# EAGLE design Driver (EAGLE 8.5.2)
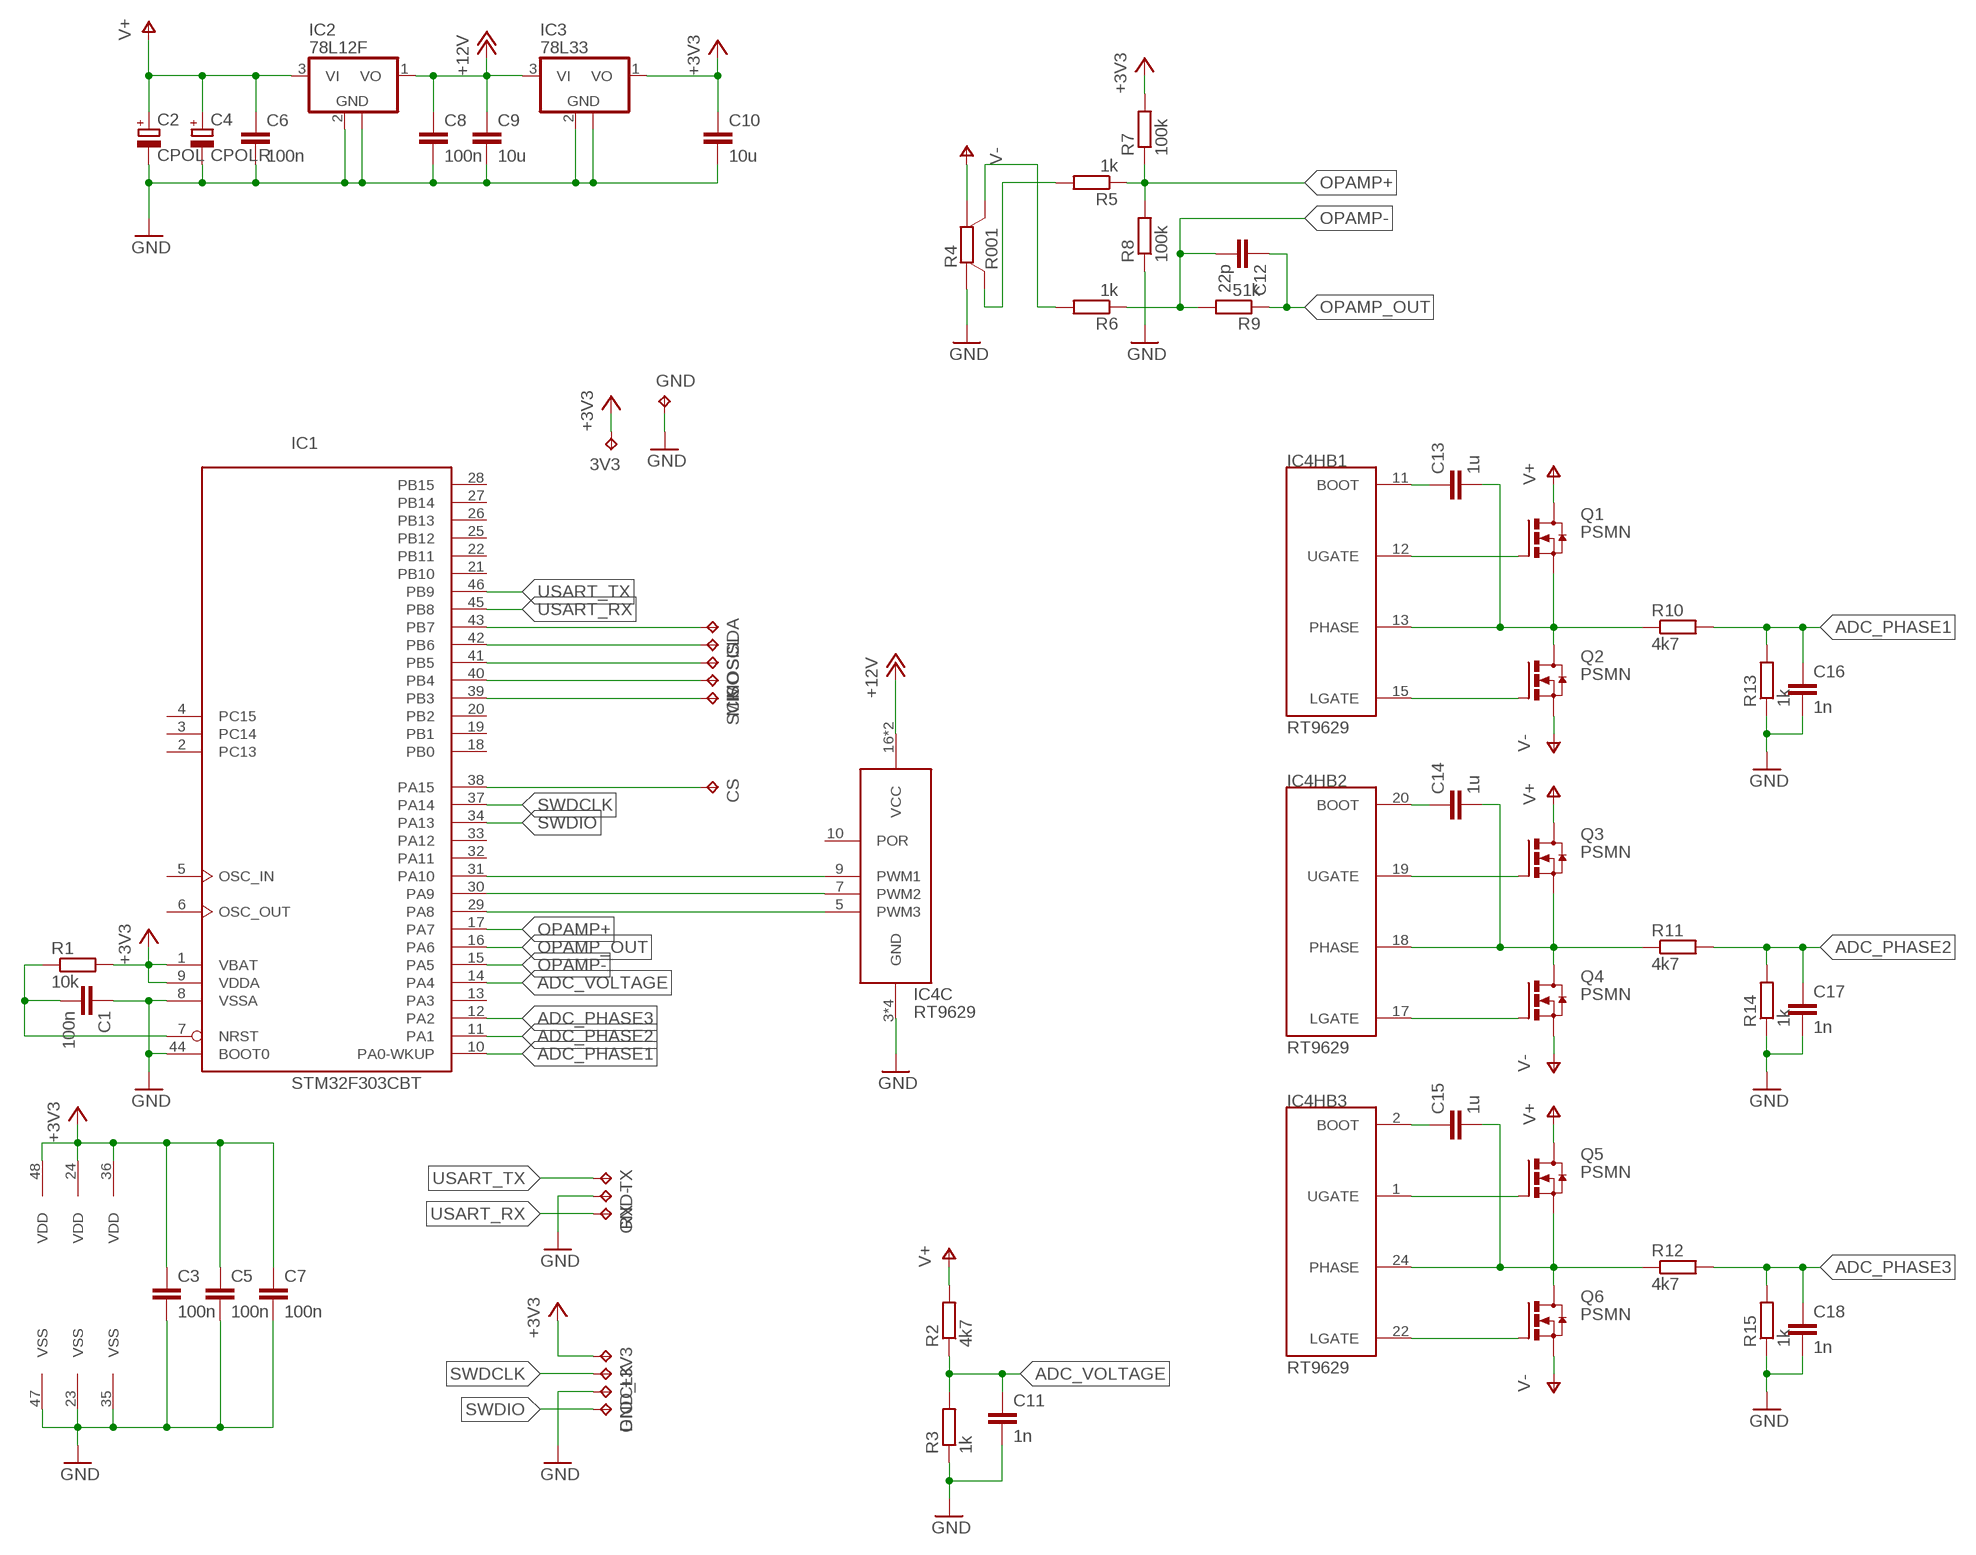
[diagram p0: schematic, sheet 1]

## Parts
3V3  TPTP10SQ  [TP10SQ]
+3V3  TPTP15R  [TP15R]
C1  100n  C-EUC0603K  [C0603K]
C2  CPOL  [SIDEWAYS-5.08]
C3  100n  C-EUC0603K  [C0603K]
C4  CPOLR  [SIDEWAYS-5.08R]
C5  100n  C-EUC0603K  [C0603K]
C6  100n  C-EUC0603K  [C0603K]
C7  100n  C-EUC0603K  [C0603K]
C8  100n  C-EUC0603K  [C0603K]
C9  10u  C-EUC1206K  [C1206K]
C10  10u  C-EUC1206K  [C1206K]
C11  1n  C-EUC0603K  [C0603K]
C12  22p  C-EUC0603K  [C0603K]
C13  1u  C-EUC0603K  [C0603K]
C14  1u  C-EUC0603K  [C0603K]
C15  1u  C-EUC0603K  [C0603K]
C16  1n  C-EUC0603K  [C0603K]
C17  1n  C-EUC0603K  [C0603K]
C18  1n  C-EUC0603K  [C0603K]
CLK  TPTP15R  [TP15R]
CS  TPTP10SQ  [TP10SQ]
DIO  TPTP15R  [TP15R]
GND  TPTP10SQ  [TP10SQ]
GND-  TPTP15SQ  [TP15SQ]
GND_  TPTP15SQ  [TP15SQ]
IC1  STM32F303CBT  [LQFP48]
IC2  78L12F  [SOT89]
IC3  78L33  78L12F  [SOT89]
IC4  RT9629  [WQFN24]
MISO  TPTP10SQ  [TP10SQ]
MOSI  TPTP10SQ  [TP10SQ]
Q1  PSMN  [SOT669]
Q2  PSMN  [SOT669]
Q3  PSMN  [SOT669]
Q4  PSMN  [SOT669]
Q5  PSMN  [SOT669]
Q6  PSMN  [SOT669]
R1  10k  R-EU_R0603  [R0603]
R2  4k7  R-EU_R0603  [R0603]
R3  1k  R-EU_R0603  [R0603]
R4  R001  VISHAY_WSK1216  [WSK1216]
R5  1k  R-EU_R0603  [R0603]
R6  1k  R-EU_R0603  [R0603]
R7  100k  R-EU_R0603  [R0603]
R8  100k  R-EU_R0603  [R0603]
R9  51k  R-EU_R0603  [R0603]
R10  4k7  R-EU_R0603  [R0603]
R11  4k7  R-EU_R0603  [R0603]
R12  4k7  R-EU_R0603  [R0603]
R13  1k  R-EU_R0603  [R0603]
R14  1k  R-EU_R0603  [R0603]
R15  1k  R-EU_R0603  [R0603]
RX  TPTP15R  [TP15R]
SCK  TPTP10SQ  [TP10SQ]
SCL  TPTP10SQ  [TP10SQ]
SDA  TPTP10SQ  [TP10SQ]
TX  TPTP15R  [TP15R]

## Nets
+3V3: 3V3.TP +3V3.TP C3.1 C5.1 C7.1 C10.1 IC1.1(VBAT) IC1.9(VDDA) IC1.24(VDD) IC1.36(VDD) IC1.48(VDD) IC3.1(VO) R1.2 R7.2
+12V: C8.1 C9.1 IC2.1(VO) IC3.3(VI) IC4.16(C:VCC) IC4.21(C:VCC)
ADC_PHASE1: C16.1 IC1.10(PA0-WKUP) R10.2 R13.2
ADC_PHASE2: C17.1 IC1.11(PA1) R11.2 R14.2
ADC_PHASE3: C18.1 IC1.12(PA2) R12.2 R15.2
ADC_VOLTAGE: C11.1 IC1.14(PA4) R2.1 R3.2
GND: C1.1 C2.- C3.2 C4.- C5.2 C6.2 C7.2 C8.2 C9.2 C10.2 C11.2 C16.2 C17.2 C18.2 GND-.TP GND.TP GND_.TP IC1.8(VSSA) IC1.23(VSS) IC1.35(VSS) IC1.44(BOOT0) IC1.47(VSS) IC2.2(GND) IC2.2@1(GND) IC3.2(GND) IC3.2@1(GND) IC4.3(C:GND) IC4.14(C:GND) IC4.23(C:GND) IC4.E(C:GND) R3.1 R4.B R8.1 R13.1 R14.1 R15.1
I2C_SCL: IC1.42(PB6) SCL.TP
I2C_SDA: IC1.43(PB7) SDA.TP
N$2: IC4.12(HB1:UGATE) Q1.4(G)
N$3: IC4.15(HB1:LGATE) Q2.4(G)
N$4: C13.1 IC4.11(HB1:BOOT)
N$6: C14.1 IC4.20(HB2:BOOT)
N$8: IC4.19(HB2:UGATE) Q3.4(G)
N$9: IC4.17(HB2:LGATE) Q4.4(G)
N$10: C15.1 IC4.2(HB3:BOOT)
N$12: IC4.1(HB3:UGATE) Q5.4(G)
N$13: IC4.22(HB3:LGATE) Q6.4(G)
N$14: C1.2 IC1.7(NRST) R1.1
N$15: R4.SA R6.2
N$16: R4.SB R5.2
OPAMP+: IC1.17(PA7) R5.1 R7.1 R8.2
OPAMP-: C12.2 IC1.15(PA5) R6.1 R9.2
OPAMP_OUT: C12.1 IC1.16(PA6) R9.1
PHASE1: C13.2 IC4.13(HB1:PHASE) Q1.1(S) Q1.2(S) Q1.3(S) Q2.MB(D) R10.1
PHASE2: C14.2 IC4.18(HB2:PHASE) Q3.1(S) Q3.2(S) Q3.3(S) Q4.MB(D) R11.1
PHASE3: C15.2 IC4.24(HB3:PHASE) Q5.1(S) Q5.2(S) Q5.3(S) Q6.MB(D) R12.1
PWM1: IC1.31(PA10) IC4.9(C:PWM1)
PWM2: IC1.30(PA9) IC4.7(C:PWM2)
PWM3: IC1.29(PA8) IC4.5(C:PWM3)
SPI_MISO: IC1.40(PB4) MISO.TP
SPI_MOSI: IC1.41(PB5) MOSI.TP
SPI_NSS: CS.TP IC1.38(PA15)
SPI_SCK: IC1.39(PB3) SCK.TP
SWDCLK: CLK.TP IC1.37(PA14)
SWDIO: DIO.TP IC1.34(PA13)
USART_RX: IC1.45(PB8) RX.TP
USART_TX: IC1.46(PB9) TX.TP
V+: C2.+ C4.+ C6.1 IC2.3(VI) Q1.MB(D) Q3.MB(D) Q5.MB(D) R2.2
V-: Q2.1(S) Q2.2(S) Q2.3(S) Q4.1(S) Q4.2(S) Q4.3(S) Q6.1(S) Q6.2(S) Q6.3(S) R4.A
Unconnected: IC1.2(PC13) IC1.3(PC14) IC1.4(PC15) IC1.5(OSC_IN) IC1.6(OSC_OUT) IC1.13(PA3) IC1.18(PB0) IC1.19(PB1) IC1.20(PB2) IC1.21(PB10) IC1.22(PB11) IC1.25(PB12) IC1.26(PB13) IC1.27(PB14) IC1.28(PB15) IC1.32(PA11) IC1.33(PA12) IC4.10(C:POR)

## Library data of the parts
3V3 +3V3 CLK CS DIO GND GND- GND_ MISO MOSI RX SCK SCL SDA TX = testpad:TP: Test pad
C1 C3 C5-C18 = rcl:C-EU: CAPACITOR, European symbol; SPICEPREFIX: C
C2 C4 = custom-lcr:CPOL
IC1 = micro-stm:STM32F303C*T: ARM 32-bit Cortex™-M3 CPU 72 MHz maximum frequency 128 to 256 Kbytes of Flash memory 32 to 40 kbytes of SRAM 37 GPIOs 2.0 to 3.6 V application supply
IC2 IC3 = linear:78L*: POSITOIV-VOLTAGE REGULATORS Output up to 100 mA Source: Datasheet <http://focus.ti.com/lit/ds/symlink/ua78l05.pdf>
IC4 = power-ic:RT9629
Q1-Q6 = custom-fet:PSMN
R1-R3 R5-R15 = rcl:R-EU_: RESISTOR, European symbol; SPICEPREFIX: R
R4 = custom-lcr:VISHAY_WSK1216

## Board
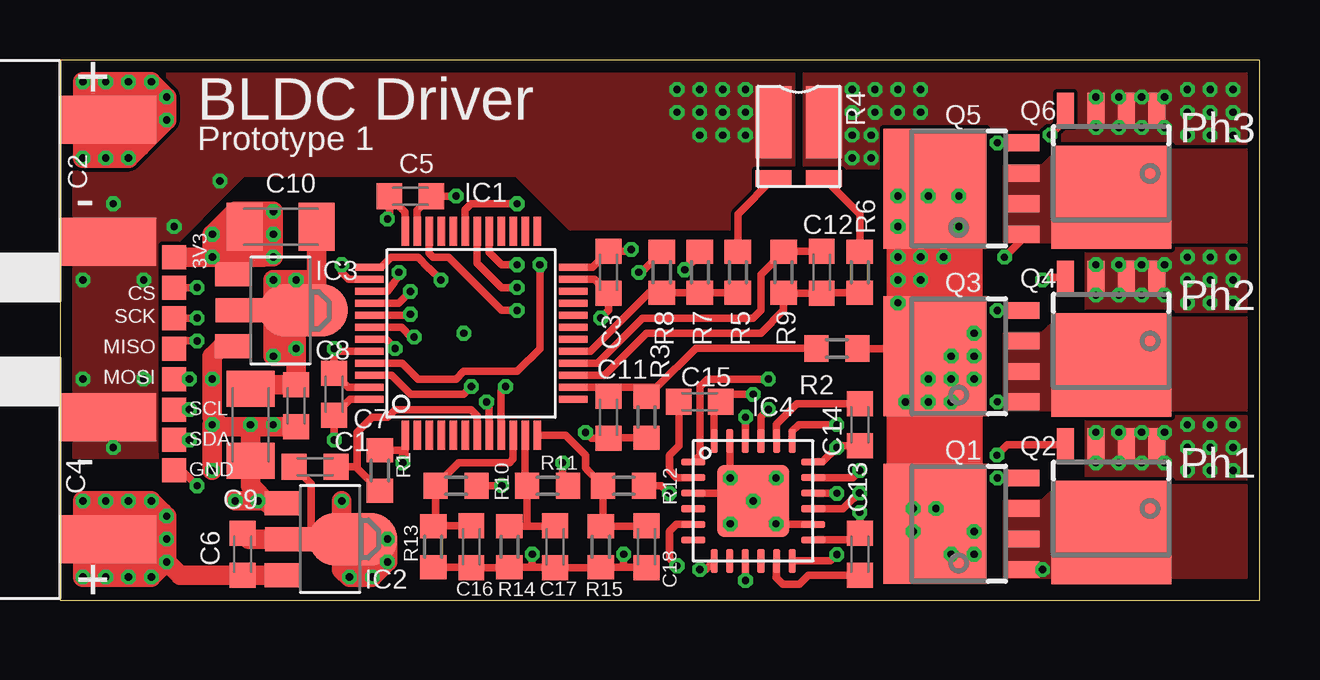
[diagram p1: board, top side]
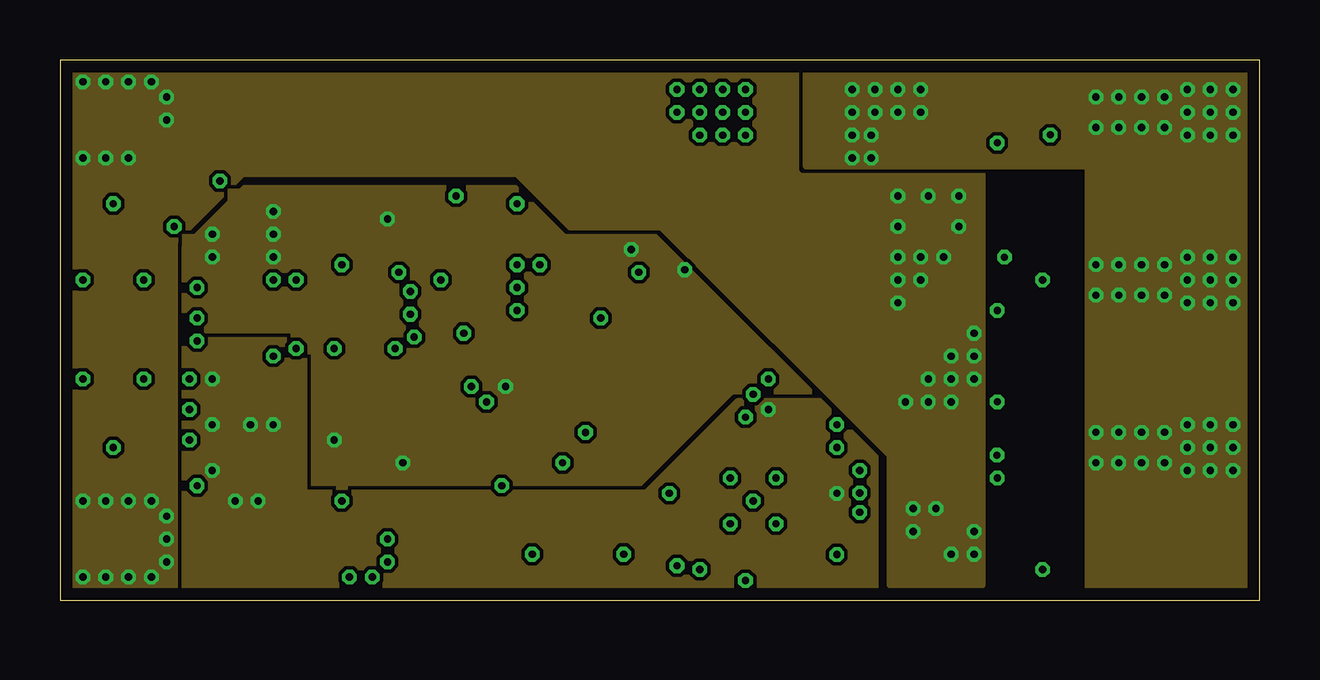
[diagram p2: board, inner layer Route2]
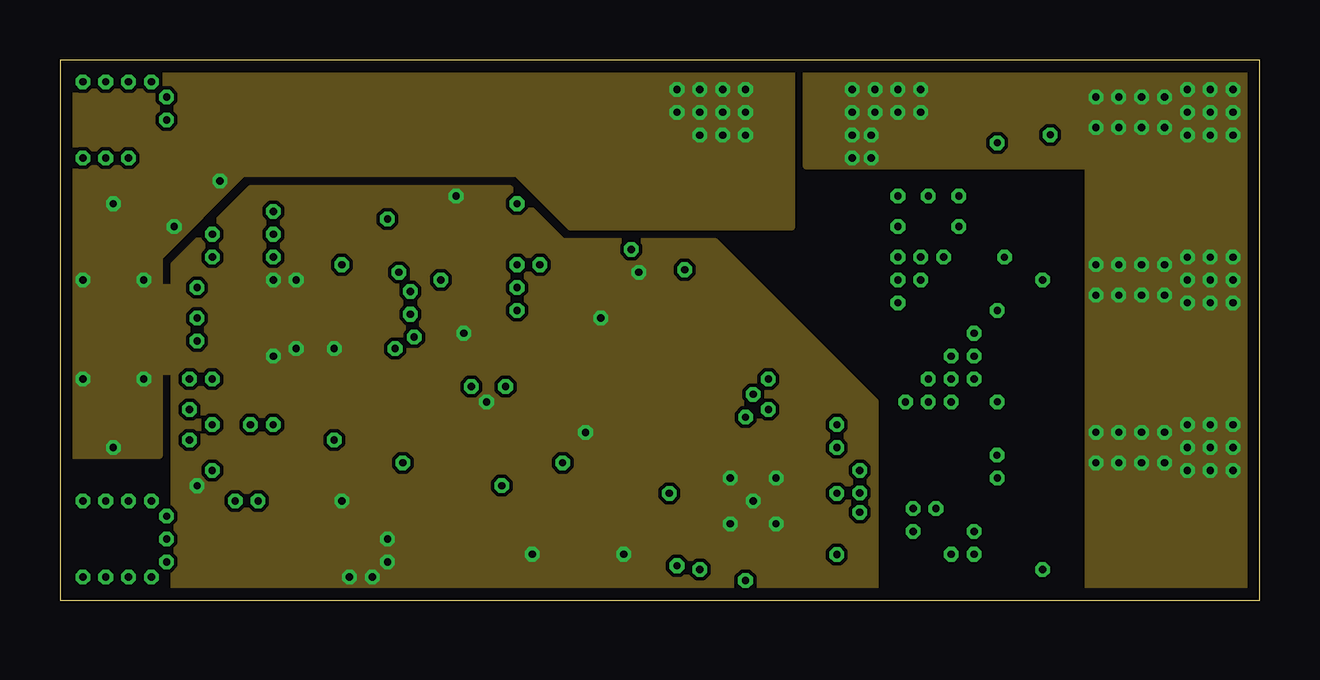
[diagram p3: board, inner layer Route15]
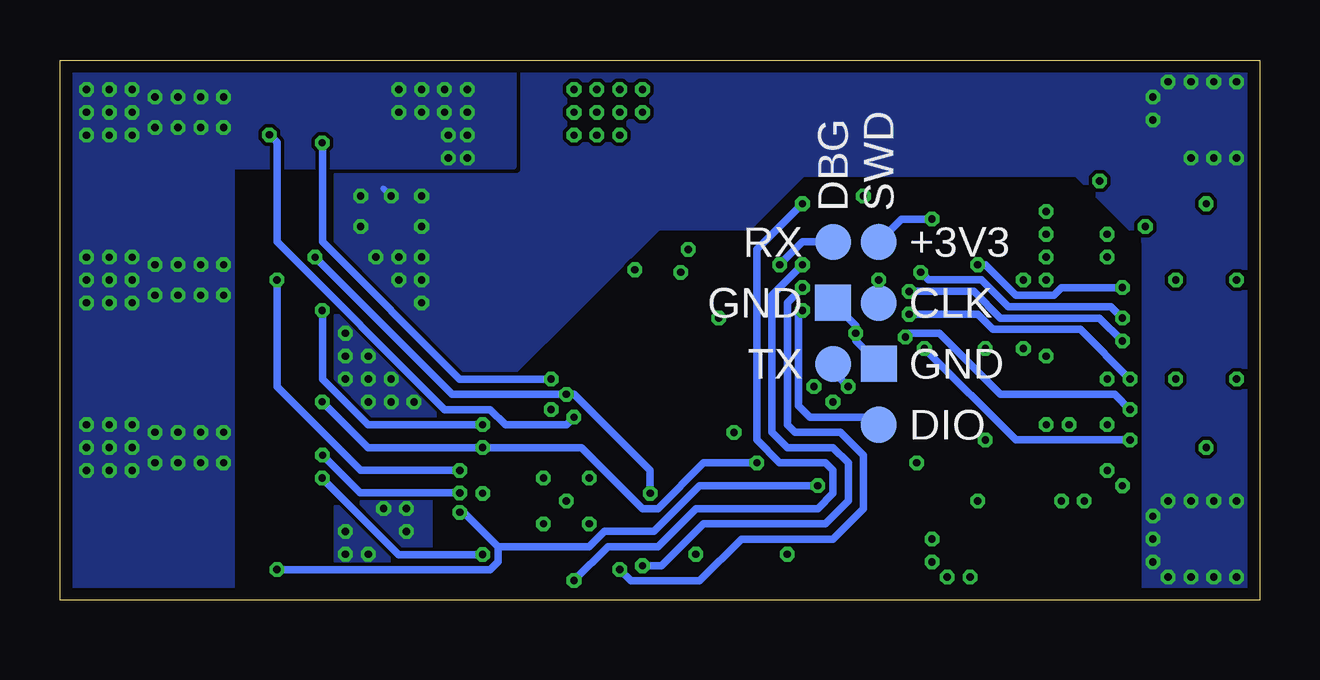
[diagram p4: board, bottom side, seen from below]

Size 50 x 22.5 mm. Coordinates in mm from the lower left corner, seen from the top.
Outline: 0,0 50,0 50,22.5 0,22.5 0,0
Copper layers (1*2*15*16): Top 0.035mm / dielectric 0.2mm / Route2 0.035mm / dielectric 1.2mm / Route15 0.035mm / dielectric 0.2mm / Bottom 0.035mm
Design rules "Elecrow_4-layer_PCB_eagle_rule *": minimum track width 6mil, minimum drill 0.3mm, track to track 6mil, track to pad 6mil, pad to pad 6mil, via to via 8mil, smd to smd 0mil, copper to edge 20mil, drill to drill 10mil, minimum pad ring 6mil, minimum via ring 6mil, stop-mask expansion 0mil, vias tented up to drill 100mil, thermal gap 10mil

### Footprints (pad centres in the part's own frame; a part is rotated, then mirrored left to right if it is on the bottom)
TP10SQ = smd 1 x 1: TP 0,0
TP15R = smd 1.5 x 1.5: TP 0,0
C0603K = smd 1.05 x 1.08: 1 -0.875,0; 2 0.875,0
SIDEWAYS-5.08 = smd 4 x 2: + 2,2.54; - 2,-2.54
SIDEWAYS-5.08R = smd 4 x 2: + 2,-2.54; - 2,2.54
C1206K = smd 1.5 x 2: 1 -1.5,0; 2 1.5,0
TP15SQ = smd 1.5 x 1.5: TP 0,0
LQFP48 = smd 0.3 x 1.2: 1 -2.75,-4.25; 2 -2.25,-4.25; 3 -1.75,-4.25; 4 -1.25,-4.25; 5 -0.75,-4.25; 6 -0.25,-4.25; 7 0.25,-4.25; 8 0.75,-4.25; 9 1.25,-4.25; 10 1.75,-4.25; 11 2.25,-4.25; 12 2.75,-4.25; 25 2.75,4.25; 26 2.25,4.25; 27 1.75,4.25; 28 1.25,4.25; 29 0.75,4.25; 30 0.25,4.25; 31 -0.25,4.25; 32 -0.75,4.25; 33 -1.25,4.25; 34 -1.75,4.25; 35 -2.25,4.25; 36 -2.75,4.25 | smd 1.2 x 0.3: 13 4.25,-2.75; 14 4.25,-2.25; 15 4.25,-1.75; 16 4.25,-1.25; 17 4.25,-0.75; 18 4.25,-0.25; 19 4.25,0.25; 20 4.25,0.75; 21 4.25,1.25; 22 4.25,1.75; 23 4.25,2.25; 24 4.25,2.75; 37 -4.25,2.75; 38 -4.25,2.25; 39 -4.25,1.75; 40 -4.25,1.25; 41 -4.25,0.75; 42 -4.25,0.25; 43 -4.25,-0.25; 44 -4.25,-0.75; 45 -4.25,-1.25; 46 -4.25,-1.75; 47 -4.25,-2.25; 48 -4.25,-2.75
SOT89 = smd 1 x 1.5: 1 -1.499,-1.981; 3 1.499,-1.981 | smd 1 x 2: 2 0,-1.727 | smd 2.2 x 3.7: 2@1 0,0.94
WQFN24 = smd 1 x 0.3: 1 -2.5,1.625; 2 -2.5,0.975; 3 -2.5,0.325; 4 -2.5,-0.325; 5 -2.5,-0.975; 6 -2.5,-1.625; 13 2.5,-1.625; 14 2.5,-0.975; 15 2.5,-0.325; 16 2.5,0.325; 17 2.5,0.975; 18 2.5,1.625 | smd 0.3 x 1: 7 -1.625,-2.5; 8 -0.975,-2.5; 9 -0.325,-2.5; 10 0.325,-2.5; 11 0.975,-2.5; 12 1.625,-2.5; 19 1.625,2.5; 20 0.975,2.5; 21 0.325,2.5; 22 -0.325,2.5; 23 -0.975,2.5; 24 -1.625,2.5 | smd 3 x 3: E 0,0
SOT669 = smd 0.7 x 1.4: 1 -1.905,-2.65; 2 -0.635,-2.65; 3 0.635,-2.65; 4 1.905,-2.65 | smd 5 x 4.3: MB 0,1
R0603 = smd 1 x 1.1: 1 -0.85,0; 2 0.85,0
WSK1216 = smd 3 x 1.5: A -1.5,1.05; B -1.5,-1.05 | smd 0.7 x 1.5: SA 0.85,1.05; SB 0.85,-1.05

### Placement (x,y rotation side)
3V3  4.76,14.29 0 top
+3V3  15.88,14.92 0 bottom
C1  10.64,5.56 0 top
C2  0,17.46 0 top
C3  22.86,13.65 270 top
C4  0,5.08 0 top
C5  14.61,16.83 0 top
C6  7.62,1.91 90 top
C7  11.43,8.57 90 top
C8  9.84,8.1 90 top
C9  7.94,7.3 90 top
C10  9.21,15.56 0 top
C11  22.86,7.62 270 top
C12  31.75,13.65 270 top
C13  33.34,1.91 90 top
C14  33.34,7.3 270 top
C15  26.67,8.26 0 top
C16  17.14,2.22 270 top
C17  20.64,2.22 270 top
C18  24.45,2.22 270 top
CLK  15.88,12.38 0 bottom
CS  4.76,13.02 0 top
DIO  15.88,7.3 0 bottom
GND  4.76,5.4 0 top
GND-  17.78,12.38 0 bottom
GND_  15.88,9.84 0 bottom
IC1  17.14,11.11 0 top
IC2  11.27,2.54 270 top
IC3  9.21,12.06 270 top
IC4  28.89,4.13 0 top
MISO  4.76,10.48 0 top
MOSI  4.76,9.21 0 top
Q1  37.47,3.17 90 top
Q2  43.81,3.81 180 top
Q3  37.47,10.16 90 top
Q4  43.81,10.79 180 top
Q5  37.47,17.14 90 top
Q6  43.81,17.78 180 top
R1  13.34,5.4 90 top
R2  32.38,10.48 0 top
R3  24.45,7.62 90 top
R4  30.8,18.41 270 top
R5  28.26,13.65 90 top
R6  33.34,13.65 90 top
R7  26.67,13.65 90 top
R8  25.08,13.65 270 top
R9  30.16,13.65 270 top
R10  16.51,4.76 180 top
R11  20.32,4.76 180 top
R12  23.5,4.76 180 top
R13  15.56,2.22 90 top
R14  18.73,2.22 90 top
R15  22.54,2.22 90 top
RX  17.78,14.92 0 bottom
SCK  4.76,11.75 0 top
SCL  4.76,7.94 0 top
SDA  4.76,6.67 0 top
TX  17.78,9.84 0 bottom

### Tracks (layer width: path | path; a pad name or v marks a point on that pad's centre or on a via)
+3V3  (via drill 0.3)
  Top 0.305: v23.81,14.61 23.73,14.53 C3.1 22.2,13.86 IC1.24 | IC1.36 14.39,16.16 C5.1 13.73,15.88 v13.65,15.88 | IC1.48 12.1,8.36 C7.1 v11.43,6.67 | IC1.1 14.39,5.82 v14.29,5.71 14.29,6.25 R1.2 | v18.57,8.89 18.39,8.71 IC1.9 | R7.2 26.67,14.39 v26.04,13.76
  Top 0.813: 7.23,14.61 7.23,15.08 C10.1 8.34,16.19 v8.89,16.19 | 7.23,14.61 IC3.1 | v8.89,16.19 v8.89,14.3 | v8.89,14.3 8.49,14.3 8.48,14.29 v6.35,14.29 | v6.35,14.29 v6.35,15.24 | v8.89,16.19 8.26,16.19 8.26,14.94 v8.89,14.3 | v6.35,15.24 7.3,16.19 v8.89,16.19 | 7.23,14.61 6.99,14.61 v6.35,15.24 | 3V3.TP v6.35,14.29
  Bottom 0.305: +3V3.TP 14.92,15.88 v13.65,15.88
  other vias: 8.89,15.24
  pour Route2 (rank 6): -1.59,-1.91 -1.59,17.14 33.97,17.14 33.97,-0.95 34.29,-1.27 33.66,-1.91
+12V  (via drill 0.3)
  Top 0.305: IC4.16 v32.38,4.45 | IC4.21 29.22,7.63 v29.53,7.94
  Top 0.813: C8.1 7.94,7.22 | 7.94,7.22 6.75,7.22 6.35,7.62 6.35,10.16 6.76,10.57 IC3.3 | 7.94,7.22 C9.1 7.94,4.76 8.66,4.04 IC2.1 9.2,4.13 v7.3,4.13 | v6.35,5.4 v6.35,7.3
  other vias: 8.26,4.13 6.35,9.21 7.94,7.3 8.89,7.3
  pour Route2 (rank 5): -0.64,10.79 10.16,10.79 10.16,4.45 24.45,4.45 28.26,8.26 33.97,8.26 33.97,-0.95 0,-0.95 -0.64,-0.32
ADC_PHASE1
  Top 0.305: IC1.10 18.89,5.88 18.73,5.71 16.61,5.71 R10.2 15.66,3.17 R13.2 15.58,3.1 C16.1
ADC_PHASE2
  Top 0.305: IC1.11 19.39,4.84 R11.2 19.47,3.17 19.37,3.07 | R14.2 19.37,3.07 | 19.37,3.07 20.61,3.07 C17.1
ADC_PHASE3
  Top 0.305: C18.1 24.42,3.07 R15.2 22.64,3.17 R12.2 21.98,5.43 21.98,5.44 21.91,5.51 21.91,6.03 21.08,6.86 IC1.12
ADC_VOLTAGE
  Top 0.305: IC1.14 23,8.86 | 23,8.86 24.5,8.86 | 24.5,8.86 24.86,8.86 26.5,10.5 31.4,10.5 R2.1 | C11.1 23,8.63 23,8.86 | R3.2 24.5,8.52 24.5,8.86
GND  (via drill 0.3)
  Top 0.305: IC4.14 29.87,3.15 v29.84,3.17 IC4.E | IC4.3 28.57,4.45 IC4.E | IC4.23 27.92,5.1 v27.94,5.08 IC4.E | 19.68,1.37 R14.1 18.71,1.35 C16.2 17.12,1.37 R13.1 15.53,1.35 | 19.68,1.37 20.61,1.37 C17.2 22.52,1.35 R15.1 23.5,1.37 | 23.5,1.37 24.42,1.37 C18.2 | IC1.23 22.27,13.36 C3.2 22.86,12.06 v22.54,11.75 | IC1.35 14.89,16.24 C5.2 v16.51,16.83 | IC1.47 12.02,8.86 C7.2 v11.43,10.48 11.43,10.36 IC1.44 | IC1.8 17.89,8.14 v17.78,8.26 | R3.1 22.89,6.77 C11.2 22.15,6.75 v21.91,6.99 | 19.68,1.37 v19.68,1.91 | C1.1 10.48,4.84 10.48,2.54 | IC2.2@1 v13.65,2.54 | v23.5,1.91 23.5,1.37 | R8.1 24.23,13.65 v24.13,13.65 | GND.TP 5.08,5.4 v5.71,4.76
  Top 0.813: C6.2 7.86,2.54 IC2.2 10.48,2.54 11.75,2.54 | 11.75,2.54 IC2.2@1 | IC3.2 9.53,12.06 | 9.53,12.06 IC3.2@1 | 9.84,10.16 C8.2 8.11,8.97 C9.2 | 9.84,10.16 9.84,11.75 9.53,12.06 | C10.2 10.71,13.34 | 10.71,13.34 10.71,12.62 IC3.2@1 | 11.75,2.54 v11.75,4.13 11.75,1.27 | v13.65,2.54 v13.65,1.59 v13.02,0.95 v12.06,0.95 11.75,1.27 | 13.02,1.59 12.7,1.27 11.75,1.27 | 9.53,10.16 v8.89,10.16 v8.89,13.34 v9.84,13.34 10.71,13.34 | 9.53,10.16 9.84,10.16 | IC3.2@1 9.53,11.44 9.53,10.16 | IC3.2@1 11.43,12.06
  Bottom 0.305: GND-.TP 16.83,11.43 v16.83,11.11 16.83,10.79 GND_.TP
  other vias: 28.89,4.13 29.84,5.08 27.94,3.17 9.84,10.48 0.95,9.21 0.95,13.34 3.49,13.34 3.49,9.21 4.76,15.56 6.67,17.46 2.22,6.35 2.22,16.51 28.57,19.37 28.57,20.32 28.57,21.27 27.62,19.37 27.62,20.32 27.62,21.27 26.67,21.27 26.67,20.32 26.67,19.37 25.72,20.32 25.72,21.27
  pour Route15 (rank 6): 20.95,14.92 27.3,14.92 33.97,8.26 33.97,-0.95 4.76,-0.95 4.76,9.53 3.81,9.53 3.81,13.02 4.76,13.02 4.76,13.97 7.94,17.14 18.73,17.14
  pour Top (no thermals): 0,6.03 4.13,6.03 4.13,14.29 7.62,17.78 19.05,17.78 21.27,15.56 30.48,15.56 30.48,22.54 0,22.54
  pour Route15 (no thermals): 0,6.03 4.13,6.03 4.13,14.29 7.62,17.78 19.05,17.78 21.27,15.56 30.48,15.56 30.48,22.54 0,22.54
I2C_SCL  (via drill 0.3)
  Top 0.305: SCL.TP v5.4,7.94 | IC1.42 14.23,11.36 14.64,10.95 v14.76,10.95
  Bottom 0.305: v5.4,7.94 6.03,8.57 10.79,8.57 13.34,11.11 14.61,11.11 v14.76,10.95
I2C_SDA  (via drill 0.3)
  Top 0.305: SDA.TP v5.4,6.67 | IC1.43 13.59,10.86 v13.97,10.48
  Bottom 0.305: v13.97,10.48 10.16,6.67 v5.4,6.67
N$2  (via drill 0.3)
  Top 0.305: IC4.12 32.12,1.63 v32.38,1.9 | Q1.4 v39.07,5.08
  Bottom 0.305: v32.38,1.9 35.88,1.9 v39.07,5.08
N$3  (via drill 0.3)
  Top 0.305: v33.34,4.46 33.14,4.26 33.09,4.26 32.63,3.8 IC4.15 | v39.05,6.03 39.48,6.46 Q2.4
  Bottom 0.305: v33.34,4.46 37.48,4.46 v39.05,6.03
N$4
  Top 0.305: C13.1 31.19,1.03 30.82,0.66 30.14,0.66 29.84,0.95 29.87,0.97 IC4.11
N$6
  Top 0.305: C14.1 30.72,8.18 29.87,7.33 IC4.20
N$8  (via drill 0.3)
  Top 0.305: IC4.19 30.52,7.02 30.8,7.3 v32.38,7.3 | Q3.4 v39.07,12.06
  Bottom 0.305: v32.38,7.3 37.15,7.3 39.05,9.21 39.05,9.53 39.05,12.05 v39.07,12.06
N$9  (via drill 0.3)
  Top 0.305: IC4.17 33.04,5.1 v33.34,5.4 | v40.96,13.34 41.07,13.45 Q4.4
  Bottom 0.305: v33.34,5.4 37.47,5.4 40.96,8.89 v40.96,13.34
N$10
  Top 0.305: C15.1 25.8,6.43 25.4,6.03 25.4,5.4 25.7,5.1 IC4.2
N$12  (via drill 0.3)
  Top 0.305: IC4.1 26.67,6.03 26.67,8.89 26.99,9.21 v29.53,9.21 | Q5.4 v39.07,19.05
  Bottom 0.305: v29.53,9.21 33.34,9.21 39.05,14.92 39.05,19.03 v39.07,19.05
N$13  (via drill 0.3)
  Top 0.305: IC4.22 v28.57,7.62 | v41.27,19.39 41.91,20.02 Q6.4
  Bottom 0.305: v28.57,7.62 28.89,7.3 31.43,7.3 32.07,7.94 33.97,7.94 40.96,14.92 40.96,19.07 v41.27,19.39
N$14
  Top 0.305: IC1.7 17.39,7.69 17.14,7.94 13.97,7.94 13.65,7.62 13.02,7.62 12.38,6.99 12.38,5.5 | 12.38,5.5 R1.1 | C1.2 12.33,5.56 12.38,5.5
N$15
  Top 0.305: R6.2 33.34,16.07 R4.SA
N$16
  Top 0.305: R5.2 28.26,16.07 R4.SB
OPAMP+
  Top 0.305: R5.1 R7.1 R8.2 24.55,12.8 22.11,10.36 IC1.17
OPAMP-
  Top 0.305: R6.1 31.77,12.8 C12.2 30.19,12.78 R9.2 30.16,12.06 29.21,11.11 24.45,11.11 22.7,9.36 IC1.15
OPAMP_OUT
  Top 0.305: C12.1 30.19,14.53 R9.1 29.21,13.55 29.21,12.06 28.89,11.75 24.29,11.75 22.4,9.86 IC1.16
PHASE1  (via drill 0.3)
  Top 0.305: IC4.13 33.06,2.5 C13.2 v33.34,3.65 | R10.1 v18.41,4.76
  Bottom 0.305: v33.34,3.65 33.18,3.65 31.75,2.22 | 31.75,2.22 31.75,1.59 32.07,1.27 v40.96,1.27 | 31.75,2.22 27.94,2.22 27.3,2.86 25.24,2.86 23.34,4.76 v18.41,4.76
  pour Top (no thermals): 39.37,0.95 49.85,0.95 49.85,4.76 41.59,4.76 40.96,4.13 39.37,4.13
PHASE2  (via drill 0.3)
  Top 0.305: IC4.18 31.79,5.75 v32.38,6.35 32.46,6.43 C14.2 | R11.1 arc-45 20.95,5.29 v20.95,5.72
  Bottom 0.305: v39.07,8.26 37.16,6.35 v32.38,6.35 28.26,6.35 25.72,3.81 25.08,3.81 23.18,5.72 v20.95,5.72
  pour Top (no thermals): 39.37,7.94 49.85,7.94 49.85,11.75 41.59,11.75 40.96,11.11 39.37,11.11
PHASE3  (via drill 0.3)
  Top 0.305: IC4.24 27.27,7.98 C15.2 27.86,8.57 v28.89,8.57 | v39.37,14.29 40.12,15.03 | R12.1 25.08,4.76 v25.4,4.45
  Bottom 0.305: v39.37,14.29 33.66,8.57 v28.89,8.57 28.57,8.57 25.4,5.4 v25.4,4.45
  pour Top (no thermals): 39.37,14.92 49.85,14.92 49.85,18.73 41.59,18.73 40.96,18.1 39.37,18.1
PWM1  (via drill 0.3)
  Top 0.305: IC4.9 v28.57,0.81 | v19.05,16.51 17.14,16.51 16.89,16.26 IC1.31
  Bottom 0.305: v28.57,0.81 27.16,2.22 25.08,2.22 23.5,3.81 18.41,3.81 17.78,4.45 17.78,5.4 18.1,5.71 20,5.71 20.95,6.67 20.95,14.61 v19.05,16.51
PWM2  (via drill 0.3)
  Top 0.305: IC4.7 26.91,1.27 v26.67,1.27 | IC1.30 17.39,14.04 18.41,13.02 v19.05,13.02
  Bottom 0.305: v26.67,1.27 26.19,0.79 23.34,0.79 21.59,2.54 17.78,2.54 16.51,3.81 16.51,6.03 17.46,6.99 19.37,6.99 19.68,7.3 19.68,12.38 v19.05,13.02
PWM3  (via drill 0.3)
  Top 0.305: IC4.5 25.7,3.15 25.4,2.86 25.4,1.75 v25.72,1.43 | IC1.29 17.89,14.49 18.41,13.97 v19.05,13.97
  Bottom 0.305: v25.72,1.43 24.92,1.43 23.18,3.17 18.1,3.17 17.14,4.13 17.14,5.71 17.78,6.35 19.68,6.35 20.32,6.99 20.32,12.7 v19.05,13.97
SPI_MISO  (via drill 0.3)
  Top 0.305: MISO.TP 5.08,10.79 v5.71,10.79 | IC1.40 14.11,12.36 v14.61,12.86
  Bottom 0.305: v5.71,10.79 6.67,11.75 10.79,11.75 11.91,12.86 v14.61,12.86
SPI_MOSI  (via drill 0.3)
  Top 0.305: MOSI.TP v5.4,9.21 | IC1.41 14.56,11.86 v14.61,11.91
  Bottom 0.305: v5.4,9.21 7.46,11.27 11.11,11.27 11.75,11.91 v14.61,11.91
SPI_NSS  (via drill 0.3)
  Top 0.305: CS.TP v5.71,13.02 | v11.75,13.97 11.75,13.65 12.04,13.36 IC1.38
  Bottom 0.305: v5.71,13.02 8.26,13.02 8.57,12.7 10.16,12.7 11.43,13.97 v11.75,13.97
SPI_SCK  (via drill 0.3)
  Top 0.305: SCK.TP v5.71,11.75 | IC1.39 13.65,12.86 13.96,13.27 14.13,13.5 v14.13,13.65
  Bottom 0.305: v5.71,11.75 6.19,12.22 10.48,12.22 11.35,13.1 11.43,13.18 11.59,13.34 13.81,13.34 v14.13,13.65
SWDCLK  (via drill 0.3)
  Top 0.305: v15.88,13.34 15.38,13.83 15.37,13.83 14.92,14.28 14.92,14.29 13.81,14.29 13.39,13.86 IC1.37
  Bottom 0.305: v15.88,13.34 CLK.TP
SWDIO  (via drill 0.3)
  Top 0.305: v19.05,12.06 18.41,12.06 16.19,14.29 15.56,14.29 15.39,14.45 IC1.34
  Bottom 0.305: DIO.TP 16.19,7.62 18.73,7.62 19.21,8.1 19.21,11.91 v19.05,12.06
USART_RX  (via drill 0.3)
  Top 0.305: IC1.45 14.27,9.86 14.92,9.21 16.51,9.21 16.83,9.53 19.05,9.53 20,10.48 v20,13.97
  Bottom 0.305: v20,13.97 19.05,14.92 RX.TP
USART_TX  (via drill 0.3)
  Top 0.305: IC1.46 13.81,9.36 14.61,8.57 16.83,8.57 v17.14,8.89
  Bottom 0.305: v17.14,8.89 17.78,9.53 TX.TP
V+  (via drill 0.3)
  Top 0.254: Q3.MB 36.15,10.48 | Q5.MB 36.78,16.83 v37.47,16.83
  Top 0.305: 36.15,10.48 R2.2 | 1.11,18.89 2,19.78 C2.+
  Top 0.813: IC2.3 C6.1 5,1.03 v4.45,1.59 | v0.95,0.95 0.95,3.49 | 0.95,3.49 v0.95,4.13 v3.81,4.13 | v3.81,4.13 4.29,3.65 | 4.29,3.65 v4.45,3.49 v4.45,1.59 | v4.45,1.59 v3.81,0.95 v0.95,0.95 | v0.95,0.95 1.59,1.59 3.49,1.59 4.29,2.38 4.29,3.65 | C4.+ 3.11,3.65 4.29,3.65 | v3.81,4.13 3.17,3.49 0.95,3.49 | 3.33,18.89 v2.86,18.41 v0.95,18.41 0.95,19.05 | 3.33,18.89 v4.44,20 | v4.44,20 v4.45,20 | v4.45,20 v4.45,20.95 v4.44,20.95 | v4.44,20.95 v3.81,21.59 | 0.95,20.95 v0.95,21.59 v3.81,21.59 | 0.95,20.95 0.95,19.05 | 0.95,20.95 3.81,20.95 | 3.81,20.95 v4.44,20.95 | v4.44,20.95 v4.44,20 | 3.33,18.89 1.11,18.89 0.95,19.05 | v4.45,20 3.81,20.64 3.81,20.95
  Top 4: Q1.MB Q3.MB Q5.MB
  Bottom 0.254: v36.2,16.83 36.51,17.14
  other vias: 1.91,18.41 1.91,21.59 2.86,21.59 1.91,0.95 2.86,0.95 4.45,2.54 2.86,4.13 1.91,4.13 34.92,14.29 34.92,13.34 35.88,13.34 35.88,14.29 36.83,14.29 34.92,15.56 34.92,16.83 37.47,15.56 38.1,9.21 38.1,10.16 38.1,11.11 37.15,10.16 37.15,9.21 37.15,8.26 36.2,8.26 36.2,9.21 35.24,8.26 38.1,1.91 38.1,2.86 37.15,1.91 36.51,3.81 35.56,3.81 35.56,2.86 34.92,12.38
  pour Route2 (rank 3, no thermals): 0,0 4.76,0 4.76,14.92 7.62,17.78 19.05,17.78 21.27,15.56 25.08,15.56 34.61,6.03 34.61,0.64 38.42,0.64 38.42,23.18 0,23.18
  pour Bottom (rank 3, no thermals): 0,0 4.76,0 4.76,14.92 7.62,17.78 19.05,17.78 21.27,15.56 25.08,15.56 34.61,6.03 34.61,0.64 38.42,0.64 38.42,23.18 0,23.18
V-  (via drill 0.3)
  other vias: 43.18,12.7 44.13,12.7 45.09,12.7 46.04,12.7 46.99,12.38 47.94,12.38 48.9,12.38 48.9,13.34 48.9,14.29 47.94,14.29 47.94,13.34 46.99,13.34 46.99,14.29 46.04,13.97 45.09,13.97 44.13,13.97 43.18,13.97 43.18,19.68 44.13,19.68 45.09,19.68 46.04,19.68 46.99,19.37 47.94,19.37 48.9,19.37 48.9,20.32 48.9,21.27 47.94,21.27 47.94,20.32 46.99,20.32 46.99,21.27 46.04,20.95 45.09,20.95 44.13,20.95 43.18,20.95 43.18,5.71 44.13,5.71 45.09,5.71 46.04,5.71 46.99,5.4 47.94,5.4 48.9,5.4 48.9,6.35 48.9,7.3 47.94,7.3 47.94,6.35 46.99,6.35 46.99,7.3 46.04,6.99 45.09,6.99 44.13,6.99 43.18,6.99 33.02,18.41 33.02,19.37 33.02,20.32 33.02,21.27 33.97,21.27 33.97,20.32 33.81,19.37 33.81,18.41 34.92,21.27 35.88,21.27 35.88,20.32 34.92,20.32
  pour Top (rank 2, no thermals): 42.86,0 49.85,0 49.85,22.54 31.11,22.54 31.11,18.1 42.86,18.1
  pour Route2 (rank 2, no thermals): 42.86,0 49.85,0 49.85,22.54 31.11,22.54 31.11,18.1 42.86,18.1
  pour Route15 (rank 2, no thermals): 42.86,0 49.85,0 49.85,22.54 31.11,22.54 31.11,18.1 42.86,18.1
  pour Bottom (rank 2, no thermals): 42.86,0 49.85,0 49.85,22.54 31.11,22.54 31.11,18.1 42.86,18.1

### Text on the board
tPlace: BLDC Driver | Prototype 1
tNames: + | Ph3 | - | Ph2 | - | Ph1 | +
bNames: SWD | DBG | RX | +3V3 | GND | CLK | TX | GND | DIO